# Altium schematic sheet rfrNewMemberProject.SchDoc
size A
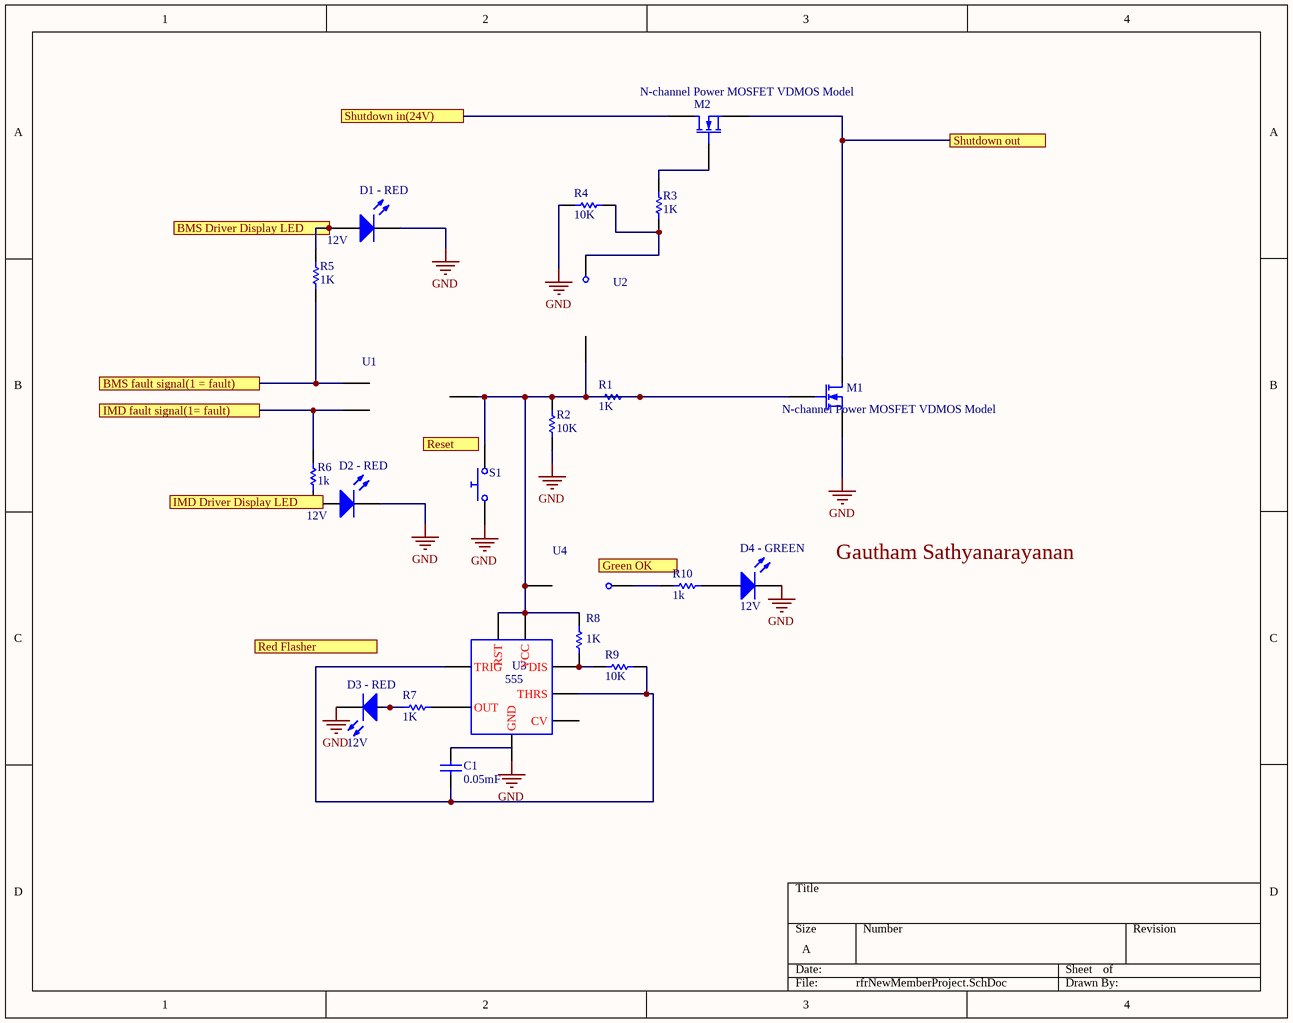
[diagram p0: rfrNewMemberProject.SchDoc]

## Parts
C1  value 0.05mF  (hidden comment: Capacitor)
D1_-_RED  12V
D2_-_RED  12V
D3_-_RED  12V
D4_-_GREEN  12V
M1  N-channel Power MOSFET VDMOS Model
M2  N-channel Power MOSFET VDMOS Model
R1  value 1K  (hidden comment: Resistor)
R2  value 10K  (hidden comment: Resistor)
R3  value 1K  (hidden comment: Resistor)
R4  value 10K  (hidden comment: Resistor)
R5  value 1K  (hidden comment: Resistor)
R6  value 1k  (hidden comment: Resistor)
R7  value 1K  (hidden comment: Resistor)
R8  value 1K  (hidden comment: Resistor)
R9  value 10K  (hidden comment: Resistor)
R10  value 1k  (hidden comment: Resistor)
S1  Push Button Normally Opened  (value not drawn)
U1  Digital OR Gate  (value not drawn)
U2  Digital NOT Gate  (value not drawn)
U3  555
U4  Digital NOT Gate  (value not drawn)

## Ports
BMS Driver Display LED, BMS fault signal(1 = fault), Green OK, IMD Driver Display LED, IMD fault signal(1= fault), Red Flasher, Reset, Shutdown in(24V), Shutdown out

## Nets
GND: D1_-_RED.2(K) D2_-_RED.2(K) D3_-_RED.2(K) D4_-_GREEN.2(K) M1.3(S) R2.1 R4.1 S1.1 U3.1(GND)
BMS Driver Display LED: D1_-_RED.1(A) R5.2 ; port BMS Driver Display LED
BMS fault signal(1 = fault): R5.1 U1.1 ; port BMS fault signal(1 = fault)
IMD fault signal(1= fault): R6.2 U1.2 ; port IMD fault signal(1= fault)
Shutdown in(24V): M2.1(D) ; port Shutdown in(24V)
Shutdown out: M1.1(D) M2.3(S) ; port Shutdown out
NetC1_1: C1.1 R9.2 U3.2(TRIG) U3.6(THRS)
NetD2_-_RED_1: D2_-_RED.1(A) R6.1
NetD3_-_RED_1: D3_-_RED.1(A) R7.1
NetD4_-_GREEN_1: D4_-_GREEN.1(A) R10.2
NetM1_2: M1.2(G) R1.1 R1.2 R2.2 R8.2 S1.2 U1.3 U2.1 U3.4(RST) U3.8(VCC) U4.1
NetM2_2: M2.2(G) R3.2
NetR3_1: R3.1 R4.2 U2.2
NetR7_2: R7.2 U3.3(OUT)
NetR8_1: R8.1 R9.1 U3.7(DIS)
NetR10_1: R10.1 U4.2

Not connected (* = marked no-connect by the designer): C1 2; U3 5(CV)

## Notes on the sheet
- Labels drawn without touching a wire or pin: Gautham Sathyanarayanan

## Library data of the parts
C1 = Capacitor: SimulationGenericComponent: True
D1_-_RED D2_-_RED D3_-_RED D4_-_GREEN = LED: Light-Emitting Diode; AF: 1; BV: 0; BV_MAX: 1e99; EG: 1.11; FC: 0.5; IBV: 0.001; IS: 1e-14; MJSW: 0.33; NTUN: 30; TNOM: 27; XTI: 3; SimulationGenericComponent: True; CJO: 0; CJP: 0; CTA: 0; CTP: 0; FCS: 0.5; FV_MAX: 1e99; IKF: 0; IKR: 0; ISR: 1e-14; JSW: 0; JTUN: 0; JTUNSW: 0; KEG: 1; KF: 0; LEVEL: 1; N: 1; NBV: 1; NR: 1; NS: 1; PHP: 1; RS: 0; TCV: 0; TLEV: 0; TLEVC: 0; TM1: 0; TM2: 0; TPB: 0; TPHP: 0; TRS: 0; TRS2: 0; TT: 0; TTT1: 0; TTT2: 0; VJ: 1; XTITUN: 3
M1 M2 = MOSFET N-ch VDMOS: XTI: 0; A: 1; BV: 1e30; EG: 1.11; FC: 0.5; IBV: 1e-10; IS: 1e-14; PHI: 0.6; TNOM: 27; VJ: 0.8; SimulationGenericComponent: True; CGDMAX: 0; CGDMIN: 0; CGS: 0; CJO: 0; KP: 1; KSUBTHRES: 0; LAMBDA: 0; M: 0.5; MTRIODE: 1; N: 1; NBV: 1; NCHAN: 1; RB: 0; RD: 0; RDS: 1e30; RG: 0; RQ: 0; RS: 0; SUBSHIFT: 0; SUBSLOPE: 0; THETA: 0; TT: 0; VQ: 0; VTO: 0
R1-R10 = Resistor: TC1: 0; SimulationGenericComponent: True; TC2: 0
S1 = Push Button NO: closed: 0; Rclosed: 1m; Ropen: 1Meg; SimulationGenericComponent: True
U1 = Digital OR: rise_delay_inst: 1n; input_load_inst: 1p; SimulationGenericComponent: True; fall_delay_inst: 1n
U2 U4 = Digital NOT: rise_delay_inst: 1n; input_load_inst: 1p; SimulationGenericComponent: True; fall_delay_inst: 1n
U3 = 555: Timer 555; SimulationGenericComponent: True